# EAGLE design UCirKitUserStudy2 (EAGLE 7.3.0)
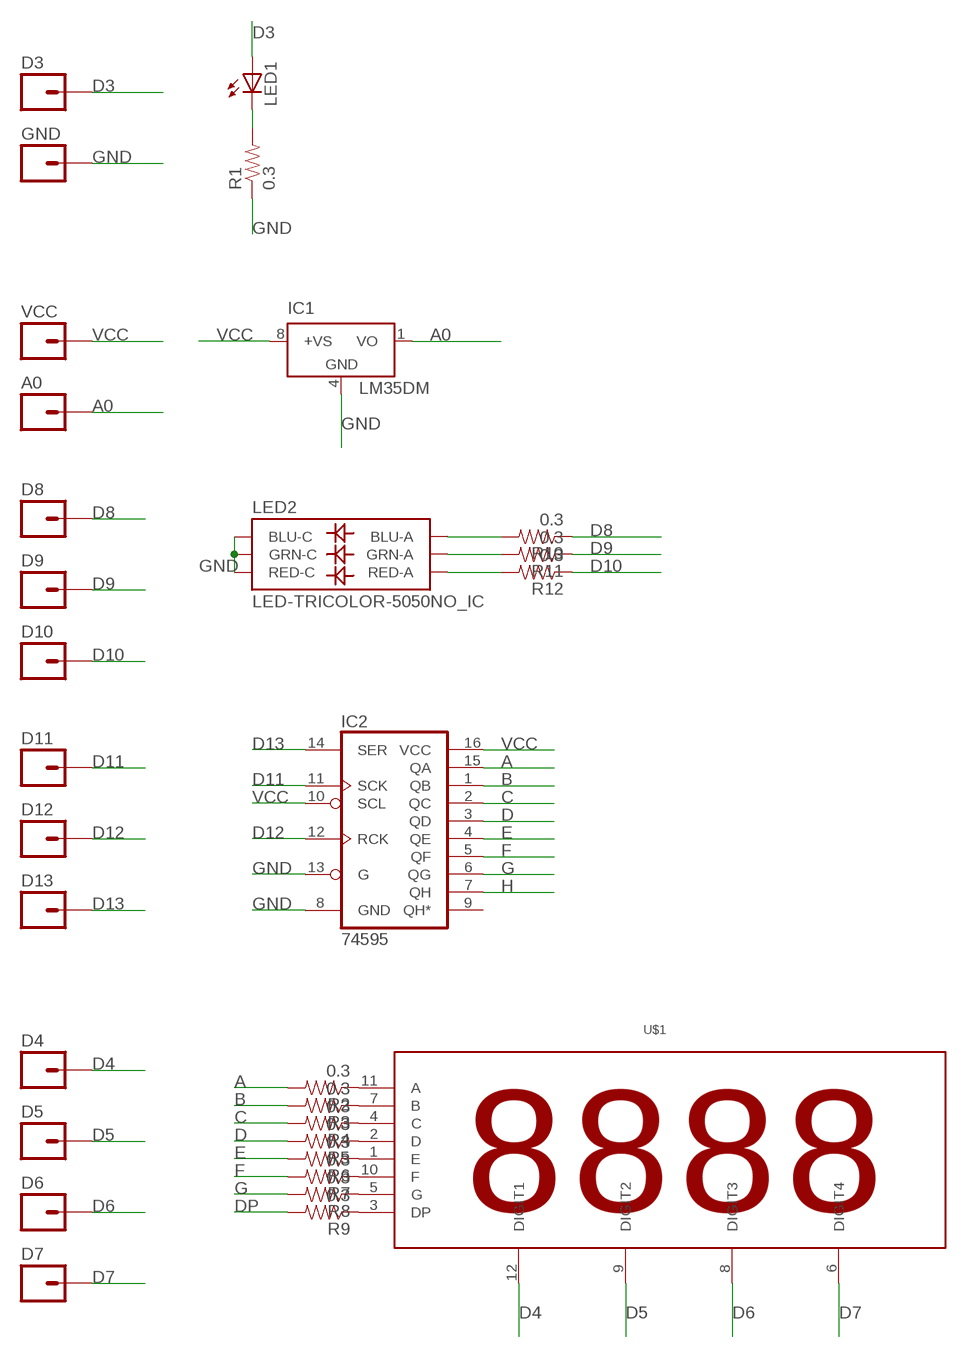
[diagram p0: schematic, sheet 1]

## Parts
A0  M01PTH  [1X01]
D3  M01PTH  [1X01]
D4  M01PTH  [1X01]
D5  M01PTH  [1X01]
D6  M01PTH  [1X01]
D7  M01PTH  [1X01]
D8  M01PTH  [1X01]
D9  M01PTH  [1X01]
D10  M01PTH  [1X01]
D11  M01PTH  [1X01]
D12  M01PTH  [1X01]
D13  M01PTH  [1X01]
GND  M01PTH  [1X01]
IC1  LM35DM  [SO08]
IC2  74595  [TSSOP16]
LED1  LEDCHIPLED_0805  [CHIPLED_0805]
LED2  LED-TRICOLOR-5050NO_IC  [LED-TRICOLOR-5050]
R1  0.3  0.3OHM-1/8W-1%(0805)  [0805]
R2  0.3  0.3OHM-1/8W-1%(0805)  [0805]
R3  0.3  0.3OHM-1/8W-1%(0805)  [0805]
R4  0.3  0.3OHM-1/8W-1%(0805)  [0805]
R5  0.3  0.3OHM-1/8W-1%(0805)  [0805]
R6  0.3  0.3OHM-1/8W-1%(0805)  [0805]
R7  0.3  0.3OHM-1/8W-1%(0805)  [0805]
R8  0.3  0.3OHM-1/8W-1%(0805)  [0805]
R9  0.3  0.3OHM-1/8W-1%(0805)  [0805]
R10  0.3  0.3OHM-1/8W-1%(0805)  [0805]
R11  0.3  0.3OHM-1/8W-1%(0805)  [0805]
R12  0.3  0.3OHM-1/8W-1%(0805)  [0805]
U$1  4DIGIT_SEVEN_SEGMENT4DIGIT_SEVEN_SEGMENT_FAR_PINS  [4DIGIT_SEVEN_SEGMENT_FAR_PINS]
VCC  M01PTH  [1X01]

## Nets
A: IC2.15(QA) R2.2
A0: A0.1 IC1.1(VO)
B: IC2.1(QB) R3.2
C: IC2.2(QC) R4.2
D: IC2.3(QD) R5.2
D3: D3.1 LED1.A
D4: D4.1 U$1.12(DIGIT1)
D5: D5.1 U$1.9(DIGIT2)
D6: D6.1 U$1.8(DIGIT3)
D7: D7.1 U$1.6(DIGIT4)
D8: D8.1 R10.1
D9: D9.1 R11.1
D10: D10.1 R12.1
D11: D11.1 IC2.11(SCK)
D12: D12.1 IC2.12(RCK)
D13: D13.1 IC2.14(SER)
DP: R9.2
E: IC2.4(QE) R6.2
F: IC2.5(QF) R7.2
G: IC2.6(QG) R8.2
GND: GND.1 IC1.4(GND) IC2.8(GND) IC2.13(G) LED2.4(BLU-C) LED2.5(RED-C) LED2.6(GRN-C) R1.1
H: IC2.7(QH)
N$1: LED1.C R1.2
N$2: R2.1 U$1.11(A)
N$3: R3.1 U$1.7(B)
N$4: R4.1 U$1.4(C)
N$5: R5.1 U$1.2(D)
N$6: R6.1 U$1.1(E)
N$7: R7.1 U$1.10(F)
N$10: R8.1 U$1.5(G)
N$11: R9.1 U$1.3(DP)
N$13: LED2.3(BLU-A) R10.2
N$14: LED2.1(GRN-A) R11.2
N$15: LED2.2(RED-A) R12.2
VCC: IC1.8(+VS) IC2.10(SCL) IC2.16(VCC) VCC.1
Unconnected: IC2.9(QH*)

## Library data of the parts
A0 D3-D13 GND VCC = SparkFun-Connectors:M01: Header 1 Standard 1-pin 0.1" header. Use with straight break away headers (SKU : PRT-00116), right angle break away headers (PRT-00553), swiss pins (PRT-00743), machine pins (PRT-00117), and female headers (PRT-00115).
IC1 = lm35:LM35: Single-Supply Centigrade Temperature Sensor Vout = (10mV/°C x Temp °C) +5mmmV Source: http://www.national.com/ds/LM/LM35.pdf
IC2 = SparkFun-DigitalIC:74*595: 8-bit SHIFT REGISTER, output latch
LED1 = led:LED: LED OSRAM: - CHIPLED LG R971, LG N971, LY N971, LG Q971, LY Q971, LO R971, LY R971 LH N974, LH R974 LS Q976, LO Q976, LY Q976 LO Q996 - Hyper CHIPLED LW Q18S LB Q993, LB Q99A, LB R99A - SideLED LS A670, LO A670, LY A670, LG A670, LP A670 LB A673, LV A673, LT A673, LW A673 LH A674 LY A675 LS A676, LA A676, LO A676, LY A676, LW A676 LS A679, LY A679, LG A679 - Hyper Micro SIDELED® LS Y876, LA Y876, LO Y876, LY Y876 LT Y87S - SmartLED LW L88C, LW L88S LB L89C, LB L89S, LG L890 LS L89K, LO L89K, LY L89K LS L896, LA L896, LO L896, LY L896 - TOPLED LS T670, LO T670, LY T670, LG T670, LP T670 LSG T670, LSP T670, LSY T670, LOP T670, LYG T670 LG T671, LOG T671, LSG T671 LB T673, LV T673, LT T673, LW T673 LH T674 LS T676, LA T676, LO T676, LY T676, LB T676, LH T676, LSB T676, LW T676 LB T67C, LV T67C, LT T67C, LS T67K, LO T67K, LY T67K, LW E67C LS E67B, LA E67B, LO E67B, LY E67B, LB E67C, LV E67C, LT E67C LW T67C LS T679, LY T679, LG T679 LS T770, LO T770, LY T770, LG T770, LP T770 LB T773, LV T773, LT T773, LW T773 LH T774 LS E675, LA E675, LY E675, LS T675 LS T776, LA T776, LO T776, LY T776, LB T776 LHGB T686 LT T68C, LB T68C - Hyper Mini TOPLED® LB M676 - Mini TOPLED Santana® LG M470 LS M47K, LO M47K, LY M47K Source: http://www.osram.convergy.de LUXEON: - LUMILED® LXK2-PW12-R00, LXK2-PW12-S00, LXK2-PW14-U00, LXK2-PW14-V00 LXK2-PM12-R00, LXK2-PM12-S00, LXK2-PM14-U00 LXK2-PE12-Q00, LXK2-PE12-R00, LXK2-PE12-S00, LXK2-PE14-T00, LXK2-PE14-U00 LXK2-PB12-K00, LXK2-PB12-L00, LXK2-PB12-M00, LXK2-PB14-N00, LXK2-PB14-P00, LXK2-PB14-Q00 LXK2-PR12-L00, LXK2-PR12-M00, LXK2-PR14-Q00, LXK2-PR14-R00 LXK2-PD12-Q00, LXK2-PD12-R00, LXK2-PD12-S00 LXK2-PH12-R00, LXK2-PH12-S00 LXK2-PL12-P00, LXK2-PL12-Q00, LXK2-PL12-R00 Source: www.luxeon.com KINGBRIGHT: KA-3528ASYC Source: www.kingbright.com
LED2 = SparkFun-LED:LED-TRICOLOR-5050
R1-R12 = SparkFun-Resistors:0.3OHM-1/8W-1%(0805): RES-11622; PROD_ID: RES-11622
U$1 = led-7-segment:4DIGIT_SEVEN_SEGMENT

## Board
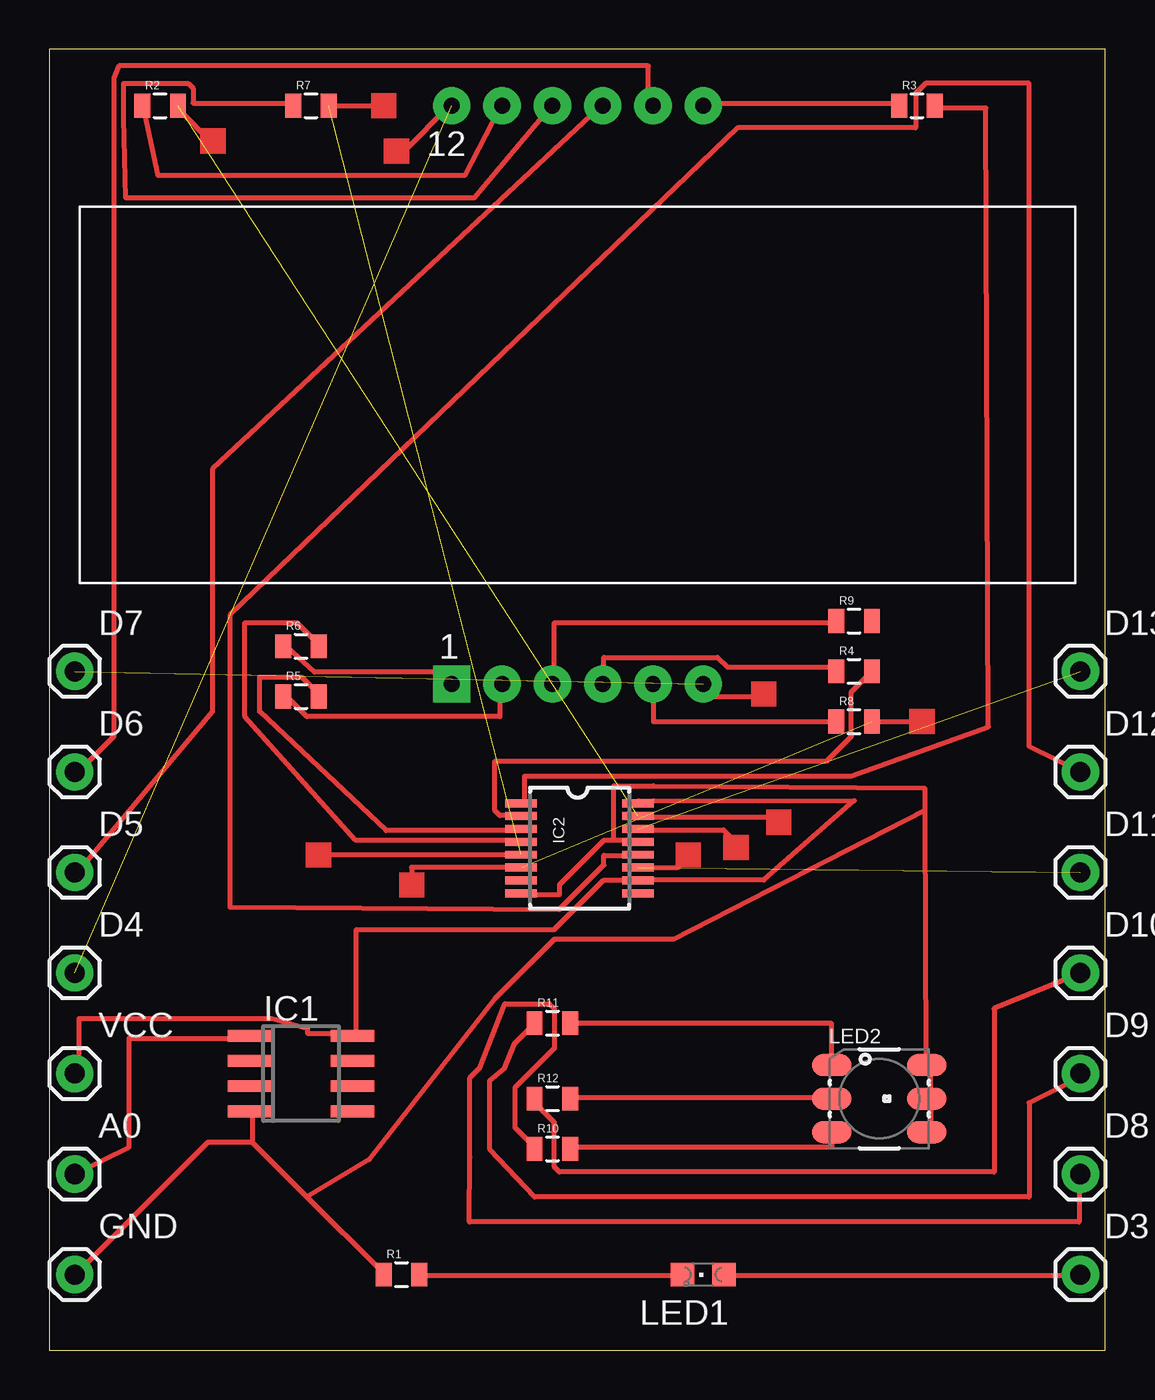
[diagram p1: board, top side]

Size 53.32 x 65.71 mm. Coordinates in mm from the lower left corner, seen from the top.
Outline: 0,0 53.32,0 53.32,65.71 0,65.71 0,0
Copper layers (1*16): Top 0.035mm / dielectric 1.5mm / Bottom 0.035mm
Design rules "default *": minimum track width 10mil, minimum drill 24mil, track to track 9mil, track to pad 9mil, pad to pad 9mil, via to via 9mil, smd to smd 8mil, copper to edge 40mil, drill to drill 8mil, minimum pad ring 10mil, minimum via ring 8mil, stop-mask expansion 4mil, vias tented up to drill 0mil, thermal gap 10mil

### Footprints (pad centres in the part's own frame; a part is rotated, then mirrored left to right if it is on the bottom)
1X01 = drill 1.016 pad 1.88: 1 0,0
SO08 = smd 0.6 x 2.2: 1 -1.905,-2.6; 2 -0.635,-2.6; 3 0.635,-2.6; 4 1.905,-2.6; 5 1.905,2.6; 6 0.635,2.6; 7 -0.635,2.6; 8 -1.905,2.6
TSSOP16 = smd 0.4 x 1.6: 1 -2.225,-2.85; 2 -1.575,-2.85; 3 -0.925,-2.85; 4 -0.275,-2.85; 5 0.375,-2.85; 6 1.025,-2.85; 7 1.675,-2.85; 8 2.325,-2.85; 9 2.325,3.05; 10 1.675,3.05; 11 1.025,3.05; 12 0.375,3.05; 13 -0.275,3.05; 14 -0.925,3.05; 15 -1.575,3.05; 16 -2.225,3.05
CHIPLED_0805 = smd 1.2 x 1.2: A 0,-1.05; C 0,1.05
LED-TRICOLOR-5050 = smd 2 x 1.1: 1 -2.4,1.7; 2 -2.4,0; 3 -2.4,-1.7; 4 2.4,-1.7; 5 2.4,0; 6 2.4,1.7
0805 = smd 0.8 x 1.2: 1 -0.9,0; 2 0.9,0
4DIGIT_SEVEN_SEGMENT_FAR_PINS = drill 0.8 pad 1.88 square: 1 -6.35,-14.605 | drill 0.8 pad 1.88: 2 -3.81,-14.605; 3 -1.27,-14.605; 4 1.27,-14.605; 5 3.81,-14.605; 6 6.35,-14.605; 7 6.35,14.605; 8 3.81,14.605; 9 1.27,14.605; 10 -1.27,14.605; 11 -3.81,14.605; 12 -6.35,14.605

### Placement (x,y rotation side)
A0  1.27,8.89 0 top
D3  52.07,3.81 0 top
D4  1.27,19.05 0 top
D5  1.27,24.13 0 top
D6  1.27,29.21 0 top
D7  1.27,34.29 0 top
D8  52.07,8.89 0 top
D9  52.07,13.97 0 top
D10  52.07,19.05 0 top
D11  52.07,24.13 0 top
D12  52.07,29.21 0 top
D13  52.07,34.29 0 top
GND  1.27,3.81 0 top
IC1  12.7,13.97 270 top
IC2  26.67,25.4 270 top
LED1  33.02,3.81 90 top
LED2  41.91,12.7 0 top
R1  17.78,3.81 0 top
R2  5.59,62.87 0 top
R3  43.81,62.87 0 top
R4  40.64,34.29 0 top
R5  12.7,33.02 0 top
R6  12.7,35.56 0 top
R7  13.21,62.87 0 top
R8  40.64,31.75 0 top
R9  40.64,36.83 0 top
R10  25.4,10.16 0 top
R11  25.4,16.51 0 top
R12  25.4,12.7 0 top
U$1  26.67,48.26 0 top
VCC  1.27,13.97 0 top

### Tracks (layer width: path | path; a pad name or v marks a point on that pad's centre or on a via)
A  (1 unrouted)
A0
  Top 0.254: IC1.1 10,15.75 4.02,15.75 4.02,10.25 1.5,9 A0.1
B
  Top 0.254: R3.2 44.5,62.75 47.3,62.75 47.42,31.48 40.5,29 24,29 24,27.75 IC2.1
C
  Top 0.254: R4.2 40.5,33.25 40.5,31 39.25,29.75 22.5,29.75 22.5,27.25 22.75,27 23.75,27 IC2.2
D
  Top 0.254: R5.2 13.5,33.25 12.75,34 10.62,34 10.62,32.25 17,26.25 23.75,26.25 IC2.3
D3
  Top 0.254: LED1.A 34.25,3.75 52,3.75 D3.1
D4  (1 unrouted)
D5
  Top 0.254: D5.1 1.5,24.25 8.23,32.25 8.23,44.5 27.75,62.75 U$1.9
D6
  Top 0.254: D6.1 1.5,29.25 3.25,31 3.25,64.25 3.5,64.88 30.25,64.88 30.25,63 U$1.8
D7  (1 unrouted)
D8
  Top 0.254: R10.1 24.5,10.25 23.5,11.25 23.5,13.25 25.5,15.25 25.5,17.25 25.25,17.5 23,17.5 21.73,14.25 21.23,13.75 21.23,9.75 21.2,6.48 52,6.48 52,8.75 D8.1
D9
  Top 0.254: R11.1 23.5,15.5 22.99,14.25 22.24,13.63 22.24,10.13 24.5,7.74 49.48,7.74 49.48,12.5 52,13.75 D9.1
D10
  Top 0.254: R12.1 24.5,12.5 25.5,11.5 25.5,9.25 25.75,9 47.71,9 47.71,17.25 52,19 D10.1
D11  (1 unrouted)
D12
  Top 0.254: IC2.12 29.5,25 28,25 28,24.5 25.75,22.25 9.11,22.38 9.11,37.13 34.75,61.75 43.75,61.75 43.75,63.5 44.25,64 49.48,64 49.48,30.5 52,29.25 D12.1
D13  (1 unrouted)
E
  Top 0.254: R6.2 13.5,35.75 12.5,36.75 9.87,36.75 9.87,32 15.48,25.75 23.75,25.75 IC2.4
F  (1 unrouted)
G  (1 unrouted)
GND
  Top 0.254: 10.25,10.5 13,7.75 | 13,7.75 16.75,4 R1.1 | 10.25,10.5 10.25,12 IC1.4 | 10.25,10.5 8,10.5 1.5,4 GND.1 | LED2.4 44.5,11 44.5,12.5 LED2.5 44.5,12.75 44.5,14.25 LED2.6 44.25,14.5 44.2,27.25 | 28.5,25.75 29.5,25.75 IC2.13 | 28.5,25.75 28,25.75 25.75,23.5 25.75,23 24,23 IC2.8 | 44.2,27.25 44.2,28.39 30.5,28.5 28.5,28.5 28.5,25.75 | 13,7.75 16.15,9.63 22.5,17.75 25.5,20.75 31.5,20.75 44.2,27.25
N$1
  Top 0.254: R1.2 18.75,3.75 31.75,3.75 LED1.C
N$2
  Top 0.254: R2.1 4.75,62.75 5.49,59.34 20.97,59.34 22.75,62.75 U$1.11
N$3
  Top 0.254: R3.1 42.75,63 33.25,63 U$1.7
N$4
  Top 0.254: R4.1 39.5,34.5 34.25,34.5 33.75,35 28,35 28,33.75 U$1.4
N$5
  Top 0.254: R5.1 12,33 13,32 22.75,32 22.75,33.5 U$1.2
N$6
  Top 0.254: R6.1 12,35.5 13.37,34.25 20.12,34.25 20.25,33.75 U$1.1
N$7
  Top 0.254: R7.1 12.25,63 7.25,63 7.25,63.75 7,64 3.75,64 3.75,62.25 3.86,58.21 21.44,58.21 25.25,62.75 U$1.10
N$8
  Top 0.254: 23.24,25.02 13.72,25.02
N$9
  Top 0.254: 23.88,24.38 18.29,24.38 18.29,23.75
N$10
  Top 0.254: R8.1 30.5,31.75 30.5,33.5 U$1.5
N$11
  Top 0.254: R9.1 39.5,36.75 25.5,36.75 25.5,33.75 U$1.3
N$12
  Top 0.254: 14.1,62.87 16.64,62.87
N$13
  Top 0.254: R10.2 26.5,10.25 39.5,10.25 LED2.3
N$14
  Top 0.254: R11.2 26.5,16.5 39.5,16.5 39.5,14.5 LED2.1
N$15
  Top 0.254: R12.2 26.5,12.75 39.5,12.75 LED2.2
N$16
  Top 0.254: 6.6,62.87 6.6,62.61 8.13,61.09
N$17
  Top 0.254: 29.84,26.92 36.32,26.92
N$18
  Top 0.254: 30.23,26.29 34.04,26.29 34.54,25.78
N$19
  Top 0.254: 30.48,24.38 31.75,24.38 32.13,24.77
N$20
  Top 0.254: 41.66,31.75 43.69,31.75
N$21
  Top 0.254: 33.02,33.02 35.56,33.02
N$22
  Top 0.254: 20.45,62.74 20.07,62.74 18.03,60.71
VCC
  Top 0.254: IC2.16 29.75,27.75 30.5,27.75 40.65,27.76 36.08,23.75 29.75,23.75 IC2.10 29.5,23.75 28,23.75 25.5,21.25 15.5,21.25 15.5,16 IC1.8 15.25,16 13.02,16 13.02,16.25 11.25,16.75 1.5,16.75 1.5,14 VCC.1
(copper drawn outside any net)
  shapes: Top area x10